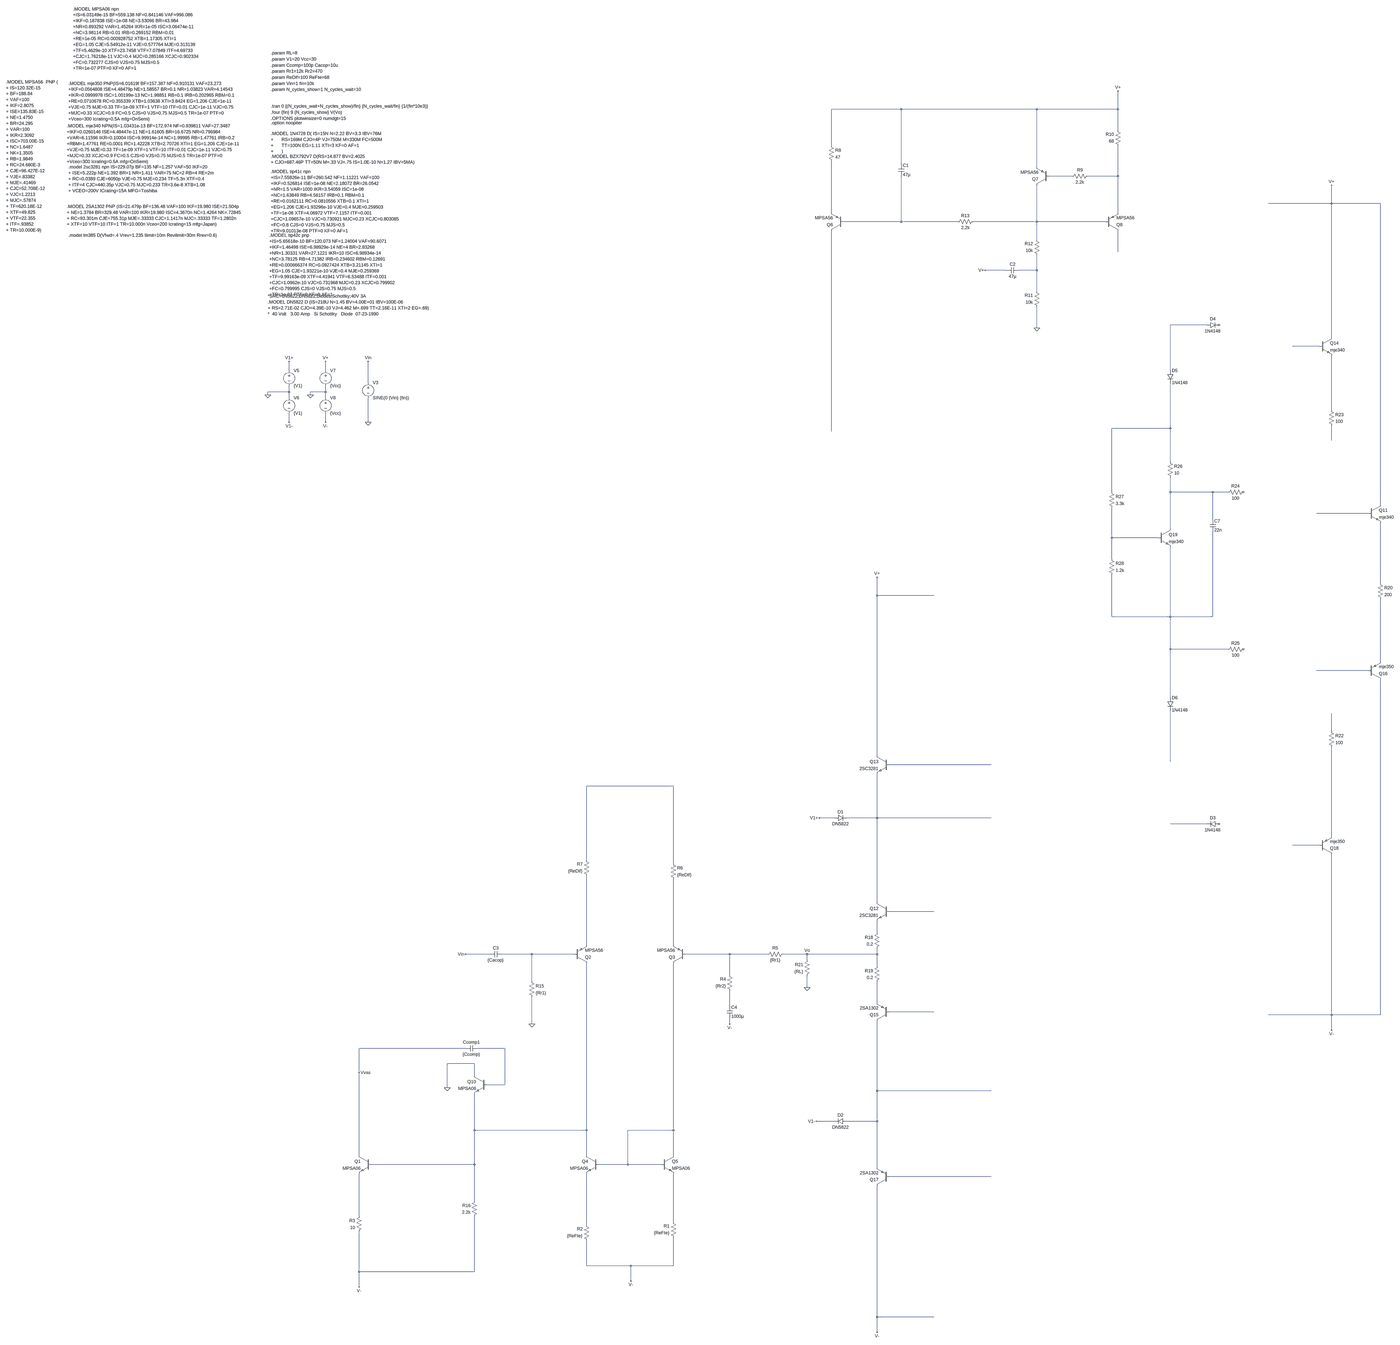
[diagram p0: schematic pcb.asc, whole sheet]
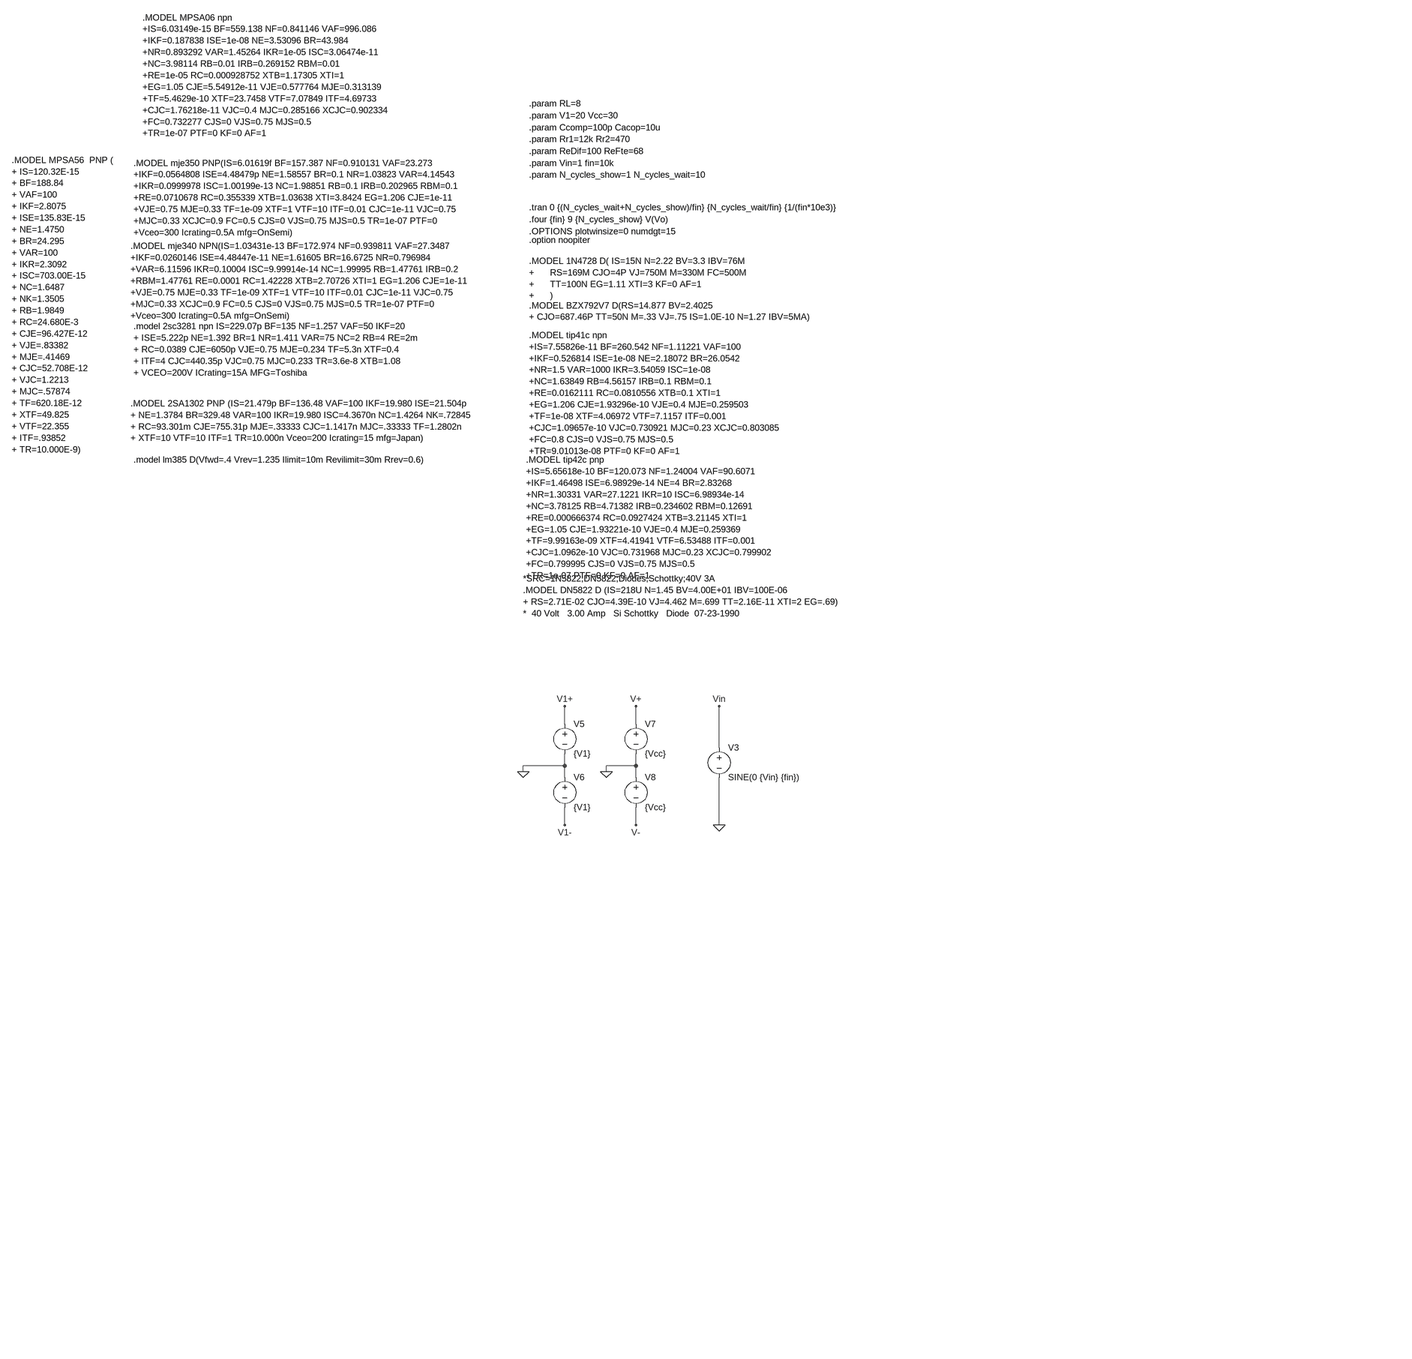
[diagram p1: schematic pcb.asc, part, row 1 of 2, column 1 of 2]
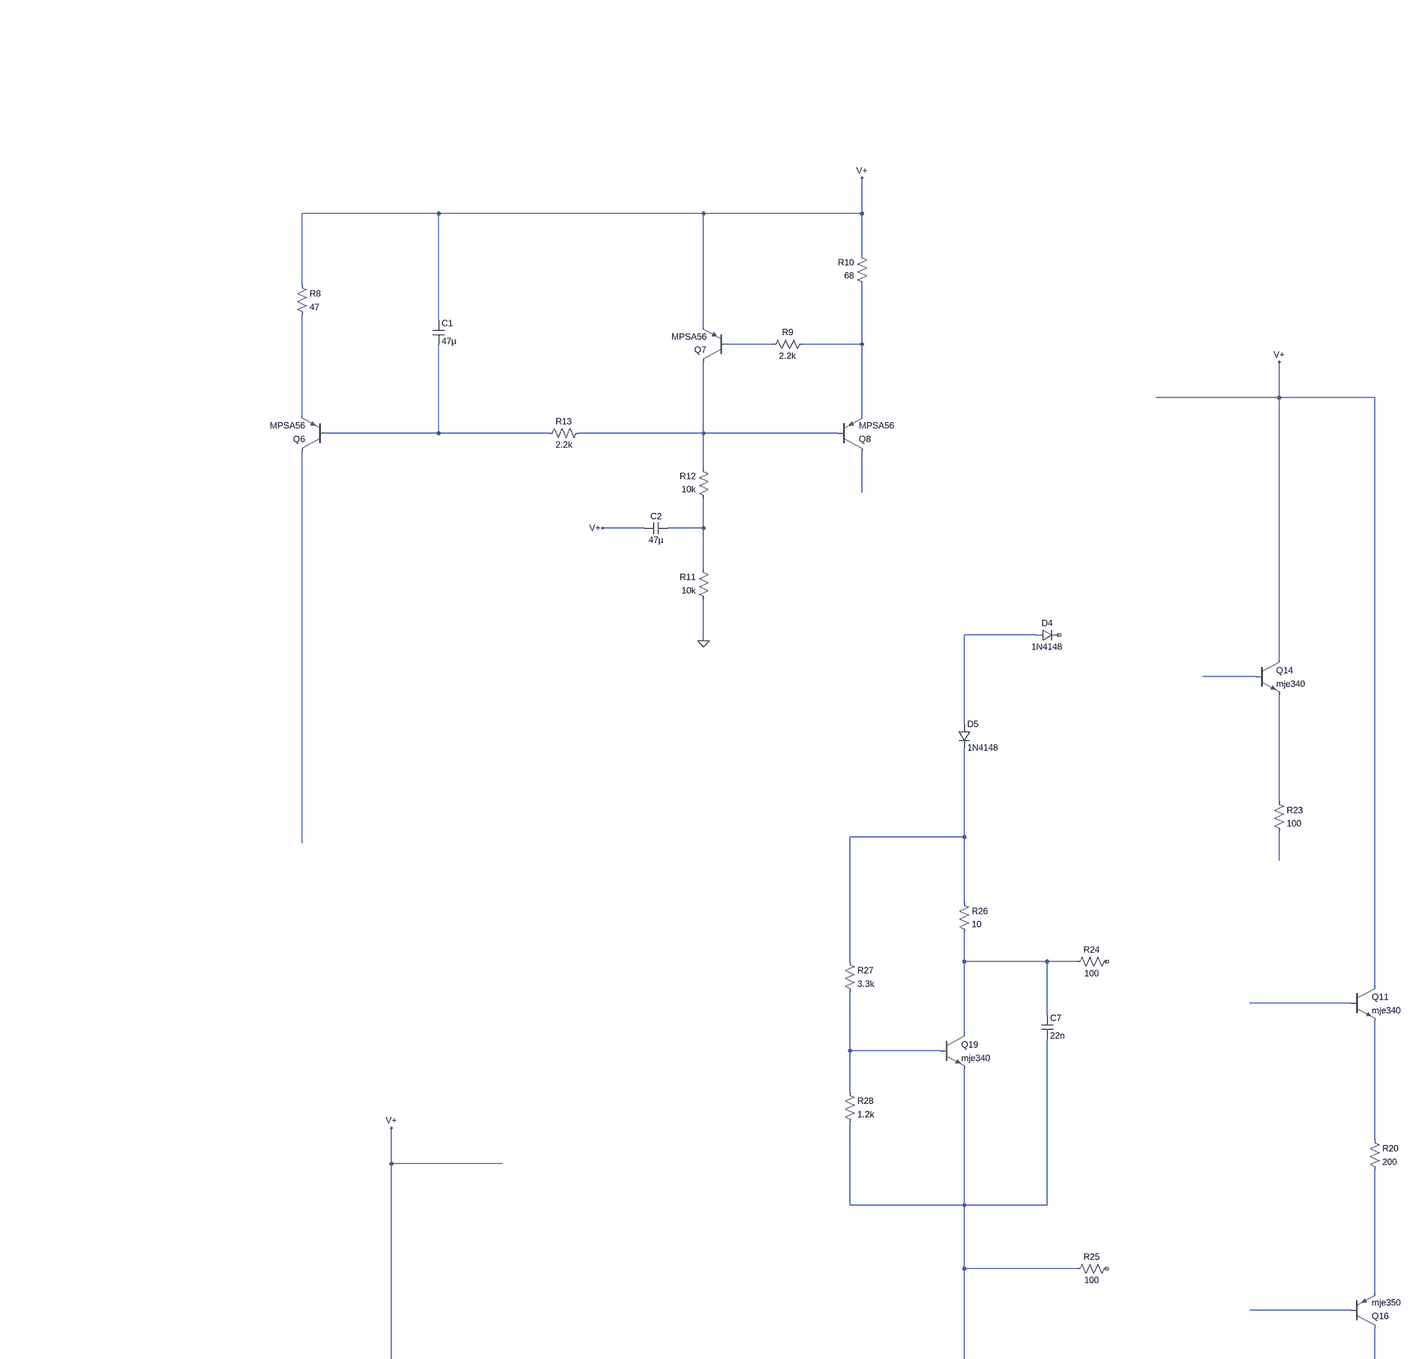
[diagram p2: schematic pcb.asc, part, row 1 of 2, column 2 of 2]
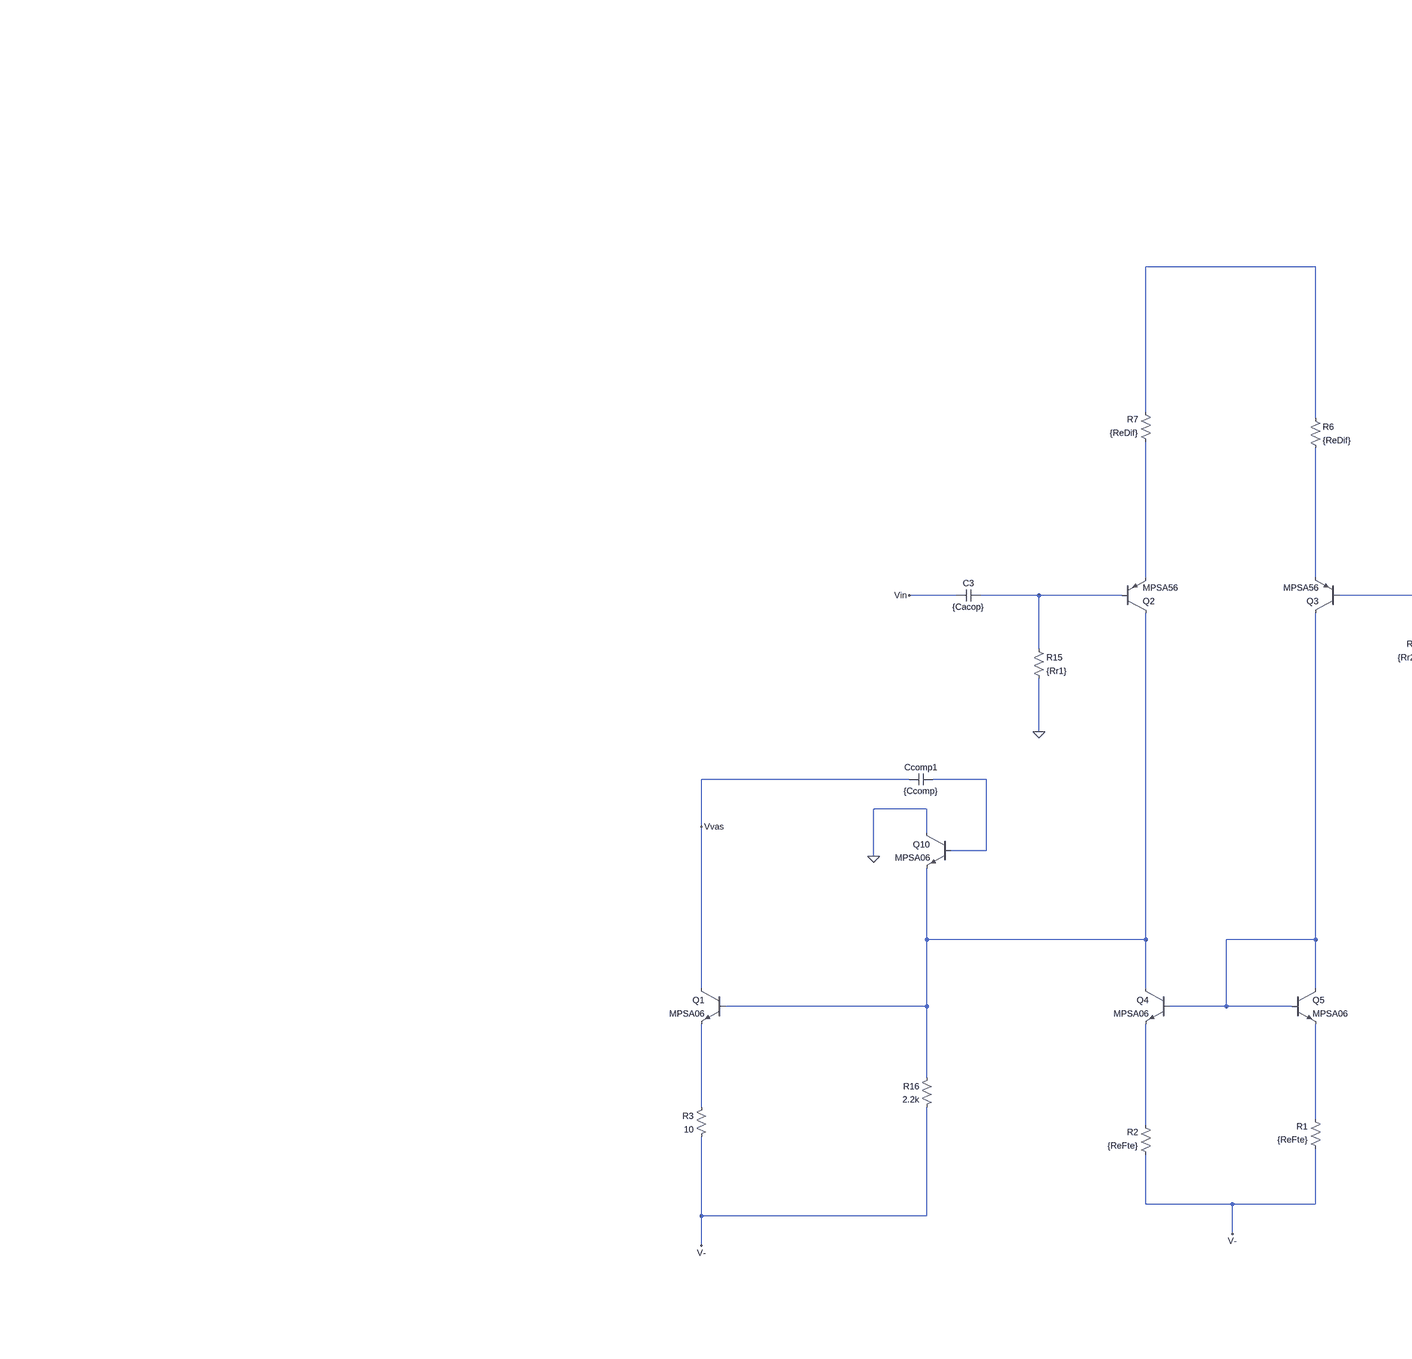
[diagram p3: schematic pcb.asc, part, row 2 of 2, column 1 of 2]
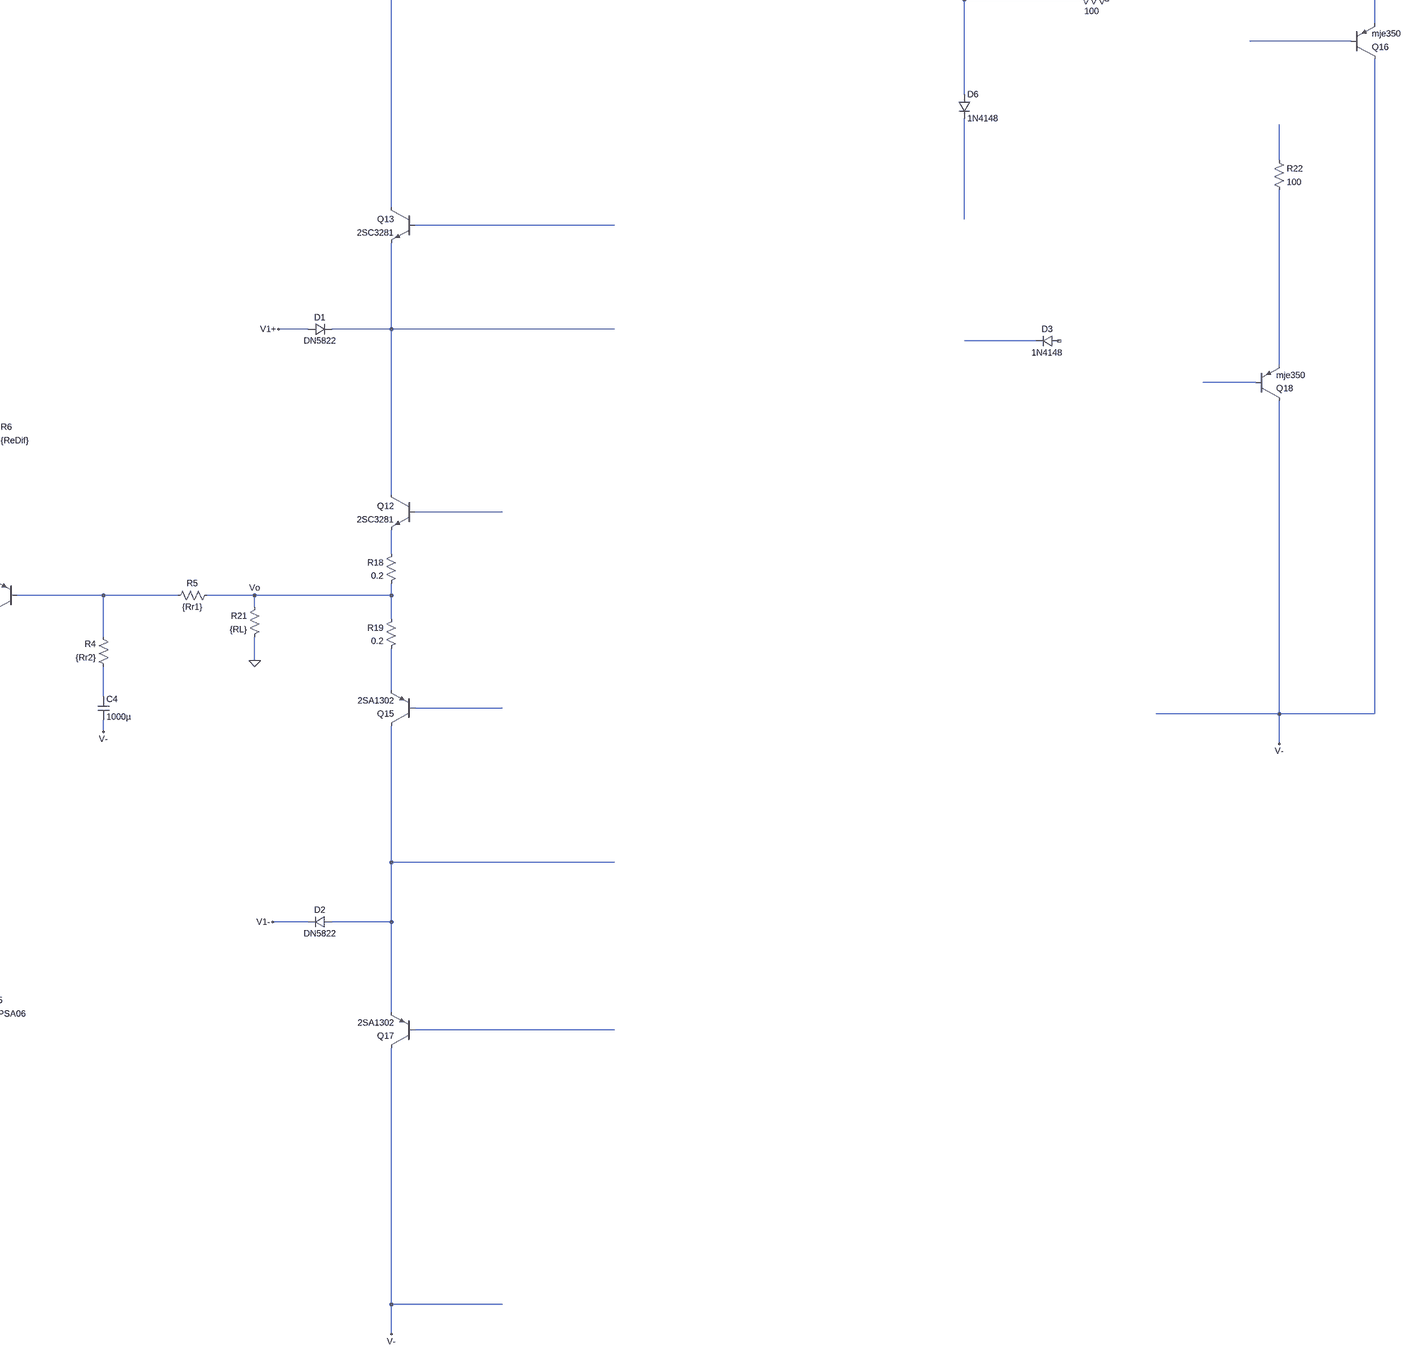
[diagram p4: schematic pcb.asc, part, row 2 of 2, column 2 of 2]
pcb.asc, the LTspice schematic file:
Version 4
SHEET 1 7264 3864
WIRE -3232 -3264 -3600 -3264
WIRE -2480 -3264 -3232 -3264
WIRE -1920 -3264 -1920 -3360
WIRE -1920 -3264 -2480 -3264
WIRE -1920 -3152 -1920 -3264
WIRE -3600 -3072 -3600 -3264
WIRE -3232 -2976 -3232 -3264
WIRE -2480 -2960 -2480 -3264
WIRE -2160 -2912 -2416 -2912
WIRE -1920 -2912 -1920 -3072
WIRE -1920 -2912 -2080 -2912
WIRE -320 -2768 -320 -2864
WIRE -320 -2768 -784 -2768
WIRE 0 -2768 -320 -2768
WIRE -3600 -2720 -3600 -2992
WIRE -1920 -2720 -1920 -2912
WIRE -3232 -2672 -3232 -2912
WIRE -3232 -2672 -3536 -2672
WIRE -2896 -2672 -3232 -2672
WIRE -2480 -2672 -2480 -2864
WIRE -2480 -2672 -2816 -2672
WIRE -1984 -2672 -2480 -2672
WIRE -2480 -2576 -2480 -2672
WIRE -1920 -2512 -1920 -2624
WIRE -2640 -2416 -2752 -2416
WIRE -2480 -2416 -2480 -2496
WIRE -2480 -2416 -2576 -2416
WIRE -2480 -2304 -2480 -2416
WIRE -1440 -2128 -1632 -2128
WIRE -2480 -2112 -2480 -2224
WIRE -320 -2064 -320 -2768
WIRE -384 -2016 -528 -2016
WIRE -6720 -1888 -6720 -1936
WIRE -6528 -1888 -6528 -1936
WIRE -1632 -1888 -1632 -2128
WIRE -6304 -1824 -6304 -1936
WIRE -6720 -1776 -6720 -1808
WIRE -6720 -1776 -6832 -1776
WIRE -6528 -1776 -6528 -1808
WIRE -6528 -1776 -6608 -1776
WIRE -6832 -1760 -6832 -1776
WIRE -6608 -1760 -6608 -1776
WIRE -6720 -1744 -6720 -1776
WIRE -6528 -1744 -6528 -1776
WIRE -320 -1680 -320 -1968
WIRE -6720 -1616 -6720 -1664
WIRE -6528 -1616 -6528 -1664
WIRE -6304 -1616 -6304 -1744
WIRE -1632 -1584 -1632 -1824
WIRE -1632 -1584 -1952 -1584
WIRE -3600 -1568 -3600 -2624
WIRE -320 -1520 -320 -1600
WIRE -1632 -1408 -1632 -1584
WIRE -1952 -1248 -1952 -1584
WIRE -1632 -1248 -1632 -1328
WIRE -1408 -1248 -1632 -1248
WIRE -1328 -1248 -1408 -1248
WIRE 0 -1184 0 -2768
WIRE -64 -1136 -400 -1136
WIRE -1408 -1104 -1408 -1248
WIRE -1632 -1056 -1632 -1248
WIRE -1952 -1008 -1952 -1168
WIRE -1696 -1008 -1952 -1008
WIRE -1952 -896 -1952 -1008
WIRE 0 -768 0 -1088
WIRE -3360 -704 -3360 -800
WIRE -3040 -704 -3360 -704
WIRE -1952 -592 -1952 -816
WIRE -1632 -592 -1632 -960
WIRE -1632 -592 -1952 -592
WIRE -1408 -592 -1408 -1040
WIRE -1408 -592 -1632 -592
WIRE -1632 -352 -1632 -592
WIRE -1328 -352 -1632 -352
WIRE 0 -288 0 -688
WIRE -64 -240 -400 -240
WIRE -1632 -96 -1632 -352
WIRE -320 80 -320 -16
WIRE -3360 208 -3360 -704
WIRE -1632 240 -1632 -32
WIRE -2720 256 -3296 256
WIRE -4624 368 -5120 368
WIRE -3584 544 -3664 544
WIRE -3360 544 -3360 304
WIRE -3360 544 -3520 544
WIRE -2720 544 -3360 544
WIRE -1440 576 -1632 576
WIRE -320 640 -320 160
WIRE -384 688 -528 688
WIRE -5120 768 -5120 368
WIRE -4624 784 -4624 368
WIRE -3360 1056 -3360 544
WIRE -3040 1104 -3296 1104
WIRE -3360 1216 -3360 1152
WIRE -5120 1280 -5120 848
WIRE -4624 1280 -4624 864
WIRE -5664 1328 -5792 1328
WIRE -5408 1328 -5600 1328
WIRE -5184 1328 -5408 1328
WIRE -4208 1328 -4560 1328
WIRE -3936 1328 -4208 1328
WIRE -3728 1328 -3856 1328
WIRE -3360 1328 -3360 1296
WIRE -3360 1328 -3728 1328
WIRE -3728 1360 -3728 1328
WIRE -3360 1392 -3360 1328
WIRE -4208 1440 -4208 1328
WIRE -5408 1472 -5408 1328
WIRE -3728 1504 -3728 1440
WIRE -3360 1584 -3360 1472
WIRE -4208 1600 -4208 1520
WIRE -3040 1632 -3296 1632
WIRE -320 1648 -320 736
WIRE -320 1648 -784 1648
WIRE 0 1648 0 -192
WIRE 0 1648 -320 1648
WIRE -5408 1696 -5408 1552
WIRE -4208 1696 -4208 1664
WIRE -320 1728 -320 1648
WIRE -5792 1824 -6352 1824
WIRE -5584 1824 -5728 1824
WIRE -5744 1904 -5888 1904
WIRE -6352 1952 -6352 1824
WIRE -5744 1968 -5744 1904
WIRE -5584 2016 -5584 1824
WIRE -5584 2016 -5680 2016
WIRE -5888 2032 -5888 1904
WIRE -3360 2048 -3360 1680
WIRE -2720 2048 -3360 2048
WIRE -3584 2208 -3680 2208
WIRE -3360 2208 -3360 2048
WIRE -3360 2208 -3520 2208
WIRE -5744 2256 -5744 2064
WIRE -5120 2256 -5120 1376
WIRE -5120 2256 -5744 2256
WIRE -4624 2256 -4624 1376
WIRE -4624 2256 -4864 2256
WIRE -6352 2416 -6352 1952
WIRE -5120 2416 -5120 2256
WIRE -4624 2416 -4624 2256
WIRE -5744 2464 -5744 2256
WIRE -5744 2464 -6288 2464
WIRE -4864 2464 -4864 2256
WIRE -4864 2464 -5056 2464
WIRE -4688 2464 -4864 2464
WIRE -3360 2480 -3360 2208
WIRE -2720 2528 -3296 2528
WIRE -5744 2656 -5744 2464
WIRE -6352 2736 -6352 2512
WIRE -4624 2768 -4624 2512
WIRE -5120 2784 -5120 2512
WIRE -5120 3088 -5120 2864
WIRE -4848 3088 -5120 3088
WIRE -4624 3088 -4624 2848
WIRE -4624 3088 -4848 3088
WIRE -6352 3120 -6352 2816
WIRE -5744 3120 -5744 2736
WIRE -5744 3120 -6352 3120
WIRE -4848 3168 -4848 3088
WIRE -6352 3200 -6352 3120
WIRE -3360 3712 -3360 2576
WIRE -3040 3712 -3360 3712
WIRE -3360 3792 -3360 3712
FLAG -6304 -1616 0
FLAG -6304 -1936 Vin
FLAG -2480 -2112 0
FLAG -2752 -2416 V+
FLAG -4208 1696 V-
FLAG -5408 1696 0
FLAG -5792 1328 Vin
FLAG -5888 2032 0
FLAG -6352 3200 V-
FLAG -1920 -3360 V+
FLAG -3728 1504 0
FLAG -3664 544 V1+
FLAG -3680 2208 V1-
FLAG -6832 -1760 0
FLAG -6608 -1760 0
FLAG -6720 -1616 V1-
FLAG -6720 -1936 V1+
FLAG -6528 -1936 V+
FLAG -6528 -1616 V-
FLAG -3728 1328 Vo
FLAG -6352 1952 Vvas
FLAG -320 -2864 V+
FLAG -3360 -800 V+
FLAG -4848 3168 V-
FLAG -320 1728 V-
FLAG -3360 3792 V-
DATAFLAG -4208 1328 ""
DATAFLAG -4864 368 ""
DATAFLAG -1632 -352 ""
DATAFLAG -1632 -1584 ""
DATAFLAG -1632 -1248 ""
DATAFLAG -176 -1136 ""
DATAFLAG -192 -240 ""
DATAFLAG 0 -960 ""
DATAFLAG -1920 -2512 ""
DATAFLAG -1280 -2128 ""
DATAFLAG -5408 1328 ""
DATAFLAG -3600 -2272 "Ic(Q6)"
DATAFLAG -5120 592 "-I(R7)"
DATAFLAG -4624 592 "I(R6)"
DATAFLAG -5120 1552 "-Ic(Q2)"
DATAFLAG -4624 1536 "-Ic(Q3)"
DATAFLAG -5120 2656 ""
DATAFLAG -4624 2656 ""
DATAFLAG -5120 1984 ""
DATAFLAG -4624 2256 ""
DATAFLAG -5744 2464 ""
DATAFLAG -5744 2224 "Ic(Q10)"
DATAFLAG -6352 1824 ""
DATAFLAG -6352 2144 "Ic(Q1)"
DATAFLAG -6352 2640 ""
DATAFLAG -6352 2944 "I(R3)"
DATAFLAG -3360 1328 ""
DATAFLAG -3600 -2864 ""
DATAFLAG -1920 -2928 ""
DATAFLAG -2480 -2672 ""
DATAFLAG -3248 -2672 ""
DATAFLAG 0 -432 ""
DATAFLAG -1312 576 ""
SYMBOL res -4608 2864 R180
WINDOW 0 36 76 Left 2
WINDOW 3 36 40 Left 2
SYMATTR InstName R1
SYMATTR Value {ReFte}
SYMBOL res -5104 2880 R180
WINDOW 0 36 76 Left 2
WINDOW 3 36 40 Left 2
SYMATTR InstName R2
SYMATTR Value {ReFte}
SYMBOL npn -6288 2416 M0
SYMATTR InstName Q1
SYMATTR Value MPSA06
SYMBOL voltage -6304 -1840 R0
WINDOW 123 0 0 Left 2
WINDOW 39 0 0 Left 2
SYMATTR InstName V3
SYMATTR Value SINE(0 {Vin} {fin})
SYMBOL res -6336 2720 M0
SYMATTR InstName R3
SYMATTR Value 10
SYMBOL res -4192 1536 R180
WINDOW 0 36 76 Left 2
WINDOW 3 36 40 Left 2
SYMATTR InstName R4
SYMATTR Value {Rr2}
SYMBOL pnp -5184 1376 M180
SYMATTR InstName Q2
SYMATTR Value MPSA56
SYMBOL pnp -4560 1376 R180
SYMATTR InstName Q3
SYMATTR Value MPSA56
SYMBOL npn -5056 2416 M0
SYMATTR InstName Q4
SYMATTR Value MPSA06
SYMBOL npn -4688 2416 R0
SYMATTR InstName Q5
SYMATTR Value MPSA06
SYMBOL res -3840 1312 R90
WINDOW 0 0 56 VBottom 2
WINDOW 3 32 56 VTop 2
SYMATTR InstName R5
SYMATTR Value {Rr1}
SYMBOL res -4640 768 R0
SYMATTR InstName R6
SYMATTR Value {ReDif}
SYMBOL res -5104 864 R180
WINDOW 0 36 76 Left 2
WINDOW 3 36 40 Left 2
SYMATTR InstName R7
SYMATTR Value {ReDif}
SYMBOL pnp -3536 -2624 R180
SYMATTR InstName Q6
SYMATTR Value MPSA56
SYMBOL pnp -2416 -2864 R180
SYMATTR InstName Q7
SYMATTR Value MPSA56
SYMBOL pnp -1984 -2624 M180
SYMATTR InstName Q8
SYMATTR Value MPSA56
SYMBOL cap -3248 -2976 R0
SYMATTR InstName C1
SYMATTR Value 47µ
SYMBOL cap -2640 -2400 R270
WINDOW 0 32 32 VTop 2
WINDOW 3 0 32 VBottom 2
SYMATTR InstName C2
SYMATTR Value 47µ
SYMBOL res -3616 -3088 R0
SYMATTR InstName R8
SYMATTR Value 47
SYMBOL res -2064 -2928 R90
WINDOW 0 0 56 VBottom 2
WINDOW 3 32 56 VTop 2
SYMATTR InstName R9
SYMATTR Value 2.2k
SYMBOL res -1904 -3056 R180
WINDOW 0 36 76 Left 2
WINDOW 3 36 40 Left 2
SYMATTR InstName R10
SYMATTR Value 68
SYMBOL res -2464 -2208 R180
WINDOW 0 36 76 Left 2
WINDOW 3 36 40 Left 2
SYMATTR InstName R11
SYMATTR Value 10k
SYMBOL res -2464 -2480 R180
WINDOW 0 36 76 Left 2
WINDOW 3 36 40 Left 2
SYMATTR InstName R12
SYMATTR Value 10k
SYMBOL res -2912 -2656 R270
WINDOW 0 32 56 VTop 2
WINDOW 3 0 56 VBottom 2
SYMATTR InstName R13
SYMATTR Value 2.2k
SYMBOL res -5424 1456 R0
SYMATTR InstName R15
SYMATTR Value {Rr1}
SYMBOL cap -5600 1312 R90
WINDOW 0 0 32 VBottom 2
WINDOW 3 32 32 VTop 2
SYMATTR InstName C3
SYMATTR Value {Cacop}
SYMBOL cap -4224 1600 R0
SYMATTR InstName C4
SYMATTR Value 1000µ
SYMBOL npn -5680 1968 M0
SYMATTR InstName Q10
SYMATTR Value MPSA06
SYMBOL res -5728 2640 M0
SYMATTR InstName R16
SYMATTR Value 2.2k
SYMBOL cap -5792 1808 M90
WINDOW 0 0 32 VBottom 2
WINDOW 3 32 32 VTop 2
SYMATTR InstName Ccomp1
SYMATTR Value {Ccomp}
SYMBOL npn -64 -1184 R0
SYMATTR InstName Q11
SYMATTR Value mje340
SYMBOL npn -3296 1056 M0
SYMATTR InstName Q12
SYMATTR Value 2SC3281
SYMBOL npn -3296 208 M0
SYMATTR InstName Q13
SYMATTR Value 2SC3281
SYMBOL npn -384 -2064 R0
SYMATTR InstName Q14
SYMATTR Value mje340
SYMBOL res -3344 1200 M0
SYMATTR InstName R18
SYMATTR Value 0.2
SYMBOL res -3344 1376 M0
SYMATTR InstName R19
SYMATTR Value 0.2
SYMBOL pnp -3296 1680 R180
SYMATTR InstName Q15
SYMATTR Value 2SA1302
SYMBOL pnp -64 -192 M180
SYMATTR InstName Q16
SYMATTR Value mje350
SYMBOL pnp -3296 2576 R180
SYMATTR InstName Q17
SYMATTR Value 2SA1302
SYMBOL pnp -384 736 M180
SYMATTR InstName Q18
SYMATTR Value mje350
SYMBOL res -16 -784 R0
SYMATTR InstName R20
SYMATTR Value 200
SYMBOL res -3712 1344 M0
SYMATTR InstName R21
SYMATTR Value {RL}
SYMBOL res -336 64 R0
SYMATTR InstName R22
SYMATTR Value 100
SYMBOL res -336 -1696 R0
SYMATTR InstName R23
SYMATTR Value 100
SYMBOL diode -1376 560 R90
WINDOW 0 0 32 VBottom 2
WINDOW 3 32 32 VTop 2
SYMATTR InstName D3
SYMATTR Value 1N4148
SYMBOL diode -1440 -2112 R270
WINDOW 0 32 32 VTop 2
WINDOW 3 0 32 VBottom 2
SYMATTR InstName D4
SYMATTR Value 1N4148
SYMBOL voltage -6720 -1904 R0
WINDOW 123 0 0 Left 2
WINDOW 39 0 0 Left 2
SYMATTR InstName V5
SYMATTR Value {V1}
SYMBOL voltage -6720 -1760 R0
WINDOW 123 0 0 Left 2
WINDOW 39 0 0 Left 2
SYMATTR InstName V6
SYMATTR Value {V1}
SYMBOL voltage -6528 -1904 R0
WINDOW 123 0 0 Left 2
WINDOW 39 0 0 Left 2
SYMATTR InstName V7
SYMATTR Value {Vcc}
SYMBOL voltage -6528 -1760 R0
WINDOW 123 0 0 Left 2
WINDOW 39 0 0 Left 2
SYMATTR InstName V8
SYMATTR Value {Vcc}
SYMBOL npn -1696 -1056 R0
SYMATTR InstName Q19
SYMATTR Value mje340
SYMBOL res -1232 -1264 R90
WINDOW 0 0 56 VBottom 2
WINDOW 3 32 56 VTop 2
SYMATTR InstName R24
SYMATTR Value 100
SYMBOL res -1232 -368 R90
WINDOW 0 0 56 VBottom 2
WINDOW 3 32 56 VTop 2
SYMATTR InstName R25
SYMATTR Value 100
SYMBOL res -1648 -1424 R0
SYMATTR InstName R26
SYMATTR Value 10
SYMBOL res -1968 -1264 R0
SYMATTR InstName R27
SYMATTR Value 3.3k
SYMBOL res -1968 -912 R0
SYMATTR InstName R28
SYMATTR Value 1.2k
SYMBOL cap -1424 -1104 R0
SYMATTR InstName C7
SYMATTR Value 22n
SYMBOL diode -1648 -1888 R0
SYMATTR InstName D5
SYMATTR Value 1N4148
SYMBOL diode -1648 -96 R0
SYMATTR InstName D6
SYMATTR Value 1N4148
SYMBOL diode -3584 528 M90
WINDOW 0 0 32 VBottom 2
WINDOW 3 32 32 VTop 2
SYMATTR InstName D1
SYMATTR Value DN5822
SYMBOL diode -3520 2224 M270
WINDOW 0 32 32 VTop 2
WINDOW 3 0 32 VBottom 2
SYMATTR InstName D2
SYMATTR Value DN5822
TEXT -6816 -3280 Left 2 !.tran 0 {(N_cycles_wait+N_cycles_show)/fin} {N_cycles_wait/fin} {1/(fin*10e3)}
TEXT -6816 -3248 Left 2 !.four {fin} 9 {N_cycles_show} V(Vo)
TEXT -6816 -3216 Left 2 !.OPTIONS plotwinsize=0 numdgt=15
TEXT -6816 -3368 Left 2 !.param N_cycles_show=1 N_cycles_wait=10
TEXT -6816 -3400 Left 2 !.param Vin=1 fin=10k
TEXT -6816 -3432 Left 2 !.param ReDif=100 ReFte=68
TEXT -6816 -3464 Left 2 !.param Rr1=12k Rr2=470
TEXT -6816 -3496 Left 2 !.param Ccomp=100p Cacop=10u
TEXT -6816 -3528 Left 2 !.param V1=20 Vcc=30
TEXT -6816 -3136 Left 2 !.MODEL 1N4728 D( IS=15N N=2.22 BV=3.3 IBV=76M \n+      RS=169M CJO=4P VJ=750M M=330M FC=500M \n+      TT=100N EG=1.11 XTI=3 KF=0 AF=1 \n+      )
TEXT -6816 -3016 Left 2 !.MODEL BZX792V7 D(RS=14.877 BV=2.4025  \n+ CJO=687.46P TT=50N M=.33 VJ=.75 IS=1.0E-10 N=1.27 IBV=5MA)
TEXT -6816 -2936 Left 2 !.MODEL tip41c npn\n+IS=7.55826e-11 BF=260.542 NF=1.11221 VAF=100\n+IKF=0.526814 ISE=1e-08 NE=2.18072 BR=26.0542\n+NR=1.5 VAR=1000 IKR=3.54059 ISC=1e-08\n+NC=1.63849 RB=4.56157 IRB=0.1 RBM=0.1\n+RE=0.0162111 RC=0.0810556 XTB=0.1 XTI=1\n+EG=1.206 CJE=1.93296e-10 VJE=0.4 MJE=0.259503\n+TF=1e-08 XTF=4.06972 VTF=7.1157 ITF=0.001\n+CJC=1.09657e-10 VJC=0.730921 MJC=0.23 XCJC=0.803085\n+FC=0.8 CJS=0 VJS=0.75 MJS=0.5\n+TR=9.01013e-08 PTF=0 KF=0 AF=1
TEXT -6824 -2600 Left 2 !.MODEL tip42c pnp\n+IS=5.65618e-10 BF=120.073 NF=1.24004 VAF=90.6071\n+IKF=1.46498 ISE=6.98929e-14 NE=4 BR=2.83268\n+NR=1.30331 VAR=27.1221 IKR=10 ISC=6.98934e-14\n+NC=3.78125 RB=4.71382 IRB=0.234602 RBM=0.12691\n+RE=0.000666374 RC=0.0927424 XTB=3.21145 XTI=1\n+EG=1.05 CJE=1.93221e-10 VJE=0.4 MJE=0.259369\n+TF=9.99163e-09 XTF=4.41941 VTF=6.53488 ITF=0.001\n+CJC=1.0962e-10 VJC=0.731968 MJC=0.23 XCJC=0.799902\n+FC=0.799995 CJS=0 VJS=0.75 MJS=0.5\n+TR=1e-07 PTF=0 KF=0 AF=1
TEXT -6832 -2280 Left 2 !*SRC=1N5822;DN5822;Diodes;Schottky;40V 3A\n.MODEL DN5822 D (IS=218U N=1.45 BV=4.00E+01 IBV=100E-06\n+ RS=2.71E-02 CJO=4.39E-10 VJ=4.462 M=.699 TT=2.16E-11 XTI=2 EG=.69)\n*  40 Volt   3.00 Amp   Si Schottky   Diode  07-23-1990
TEXT -8024 -2960 Left 2 !.model 2sc3281 npn IS=229.07p BF=135 NF=1.257 VAF=50 IKF=20\n+ ISE=5.222p NE=1.392 BR=1 NR=1.411 VAR=75 NC=2 RB=4 RE=2m\n+ RC=0.0389 CJE=6050p VJE=0.75 MJE=0.234 TF=5.3n XTF=0.4\n+ ITF=4 CJC=440.35p VJC=0.75 MJC=0.233 TR=3.6e-8 XTB=1.08\n+ VCEO=200V ICrating=15A MFG=Toshiba
TEXT -8032 -2752 Left 2 !.MODEL 2SA1302 PNP (IS=21.479p BF=136.48 VAF=100 IKF=19.980 ISE=21.504p\n+ NE=1.3784 BR=329.48 VAR=100 IKR=19.980 ISC=4.3670n NC=1.4264 NK=.72845\n+ RC=93.301m CJE=755.31p MJE=.33333 CJC=1.1417n MJC=.33333 TF=1.2802n\n+ XTF=10 VTF=10 ITF=1 TR=10.000n Vceo=200 Icrating=15 mfg=Japan)
TEXT -8032 -3176 Left 2 !.MODEL mje340 NPN(IS=1.03431e-13 BF=172.974 NF=0.939811 VAF=27.3487\n+IKF=0.0260146 ISE=4.48447e-11 NE=1.61605 BR=16.6725 NR=0.796984\n+VAR=6.11596 IKR=0.10004 ISC=9.99914e-14 NC=1.99995 RB=1.47761 IRB=0.2\n+RBM=1.47761 RE=0.0001 RC=1.42228 XTB=2.70726 XTI=1 EG=1.206 CJE=1e-11\n+VJE=0.75 MJE=0.33 TF=1e-09 XTF=1 VTF=10 ITF=0.01 CJC=1e-11 VJC=0.75\n+MJC=0.33 XCJC=0.9 FC=0.5 CJS=0 VJS=0.75 MJS=0.5 TR=1e-07 PTF=0\n+Vceo=300 Icrating=0.5A mfg=OnSemi)
TEXT -8024 -3400 Left 2 !.MODEL mje350 PNP(IS=6.01619f BF=157.387 NF=0.910131 VAF=23.273\n+IKF=0.0564808 ISE=4.48479p NE=1.58557 BR=0.1 NR=1.03823 VAR=4.14543\n+IKR=0.0999978 ISC=1.00199e-13 NC=1.98851 RB=0.1 IRB=0.202965 RBM=0.1\n+RE=0.0710678 RC=0.355339 XTB=1.03638 XTI=3.8424 EG=1.206 CJE=1e-11\n+VJE=0.75 MJE=0.33 TF=1e-09 XTF=1 VTF=10 ITF=0.01 CJC=1e-11 VJC=0.75\n+MJC=0.33 XCJC=0.9 FC=0.5 CJS=0 VJS=0.75 MJS=0.5 TR=1e-07 PTF=0\n+Vceo=300 Icrating=0.5A mfg=OnSemi)
TEXT -6816 -3560 Left 2 !.param RL=8
TEXT -8352 -3408 Left 2 !.MODEL MPSA56  PNP (\n+ IS=120.32E-15\n+ BF=188.84\n+ VAF=100\n+ IKF=2.8075\n+ ISE=135.83E-15\n+ NE=1.4750\n+ BR=24.295\n+ VAR=100\n+ IKR=2.3092\n+ ISC=703.00E-15\n+ NC=1.6487\n+ NK=1.3505\n+ RB=1.9849\n+ RC=24.680E-3\n+ CJE=96.427E-12\n+ VJE=.83382\n+ MJE=.41469\n+ CJC=52.708E-12\n+ VJC=1.2213\n+ MJC=.57874\n+ TF=620.18E-12\n+ XTF=49.825\n+ VTF=22.355\n+ ITF=.93852\n+ TR=10.000E-9)
TEXT -8000 -3792 Left 2 !.MODEL MPSA06 npn\n+IS=6.03149e-15 BF=559.138 NF=0.841146 VAF=996.086\n+IKF=0.187838 ISE=1e-08 NE=3.53096 BR=43.984\n+NR=0.893292 VAR=1.45264 IKR=1e-05 ISC=3.06474e-11\n+NC=3.98114 RB=0.01 IRB=0.269152 RBM=0.01\n+RE=1e-05 RC=0.000928752 XTB=1.17305 XTI=1\n+EG=1.05 CJE=5.54912e-11 VJE=0.577764 MJE=0.313139\n+TF=5.4629e-10 XTF=23.7458 VTF=7.07849 ITF=4.69733\n+CJC=1.76218e-11 VJC=0.4 MJC=0.285166 XCJC=0.902334\n+FC=0.732277 CJS=0 VJS=0.75 MJS=0.5\n+TR=1e-07 PTF=0 KF=0 AF=1
TEXT -6816 -3192 Left 2 !.option noopiter
TEXT -8024 -2600 Left 2 !.model lm385 D(Vfwd=.4 Vrev=1.235 Ilimit=10m Revilimit=30m Rrev=0.6)

The netlist it stands for:
* pcb.asc
R1 V- N044 {ReFte}
R2 V- N045 {ReFte}
Q1 Vvas N040 N043 0 MPSA06
V3 Vin 0 SINE(0 {Vin} {fin})
R3 N043 V- 10
R4 N036 N034 {Rr2}
Q2 N040 N033 N031 0 MPSA56
Q3 N041 N034 N032 0 MPSA56
Q4 N040 N041 N045 0 MPSA06
Q5 N041 N041 N044 0 MPSA06
R5 Vo N034 {Rr1}
R6 N024 N032 {ReDif}
R7 N031 N024 {ReDif}
Q6 N012 N004 N003 0 MPSA56
Q7 N005 N001 V+ 0 MPSA56
Q8 N006 N005 N002 0 MPSA56
C1 V+ N004 47µ
C2 V+ N007 47µ
R8 V+ N003 47
R9 N002 N001 2.2k
R10 N002 V+ 68
R11 0 N007 10k
R12 N007 N005 10k
R13 N004 N005 2.2k
R15 N033 0 {Rr1}
C3 N033 Vin {Cacop}
C4 N036 V- 1000µ
Q10 0 N038 N040 0 MPSA06
R16 N040 V- 2.2k
Ccomp1 Vvas N038 {Ccomp}
Q11 V+ N015 N017 0 mje340
Q12 N025 N029 N030 0 2SC3281
Q13 V+ N023 N025 0 2SC3281
Q14 V+ N009 N010 0 mje340
R18 N030 Vo 0.2
R19 Vo N035 0.2
Q15 N039 N037 N035 0 2SA1302
Q16 V- N020 N019 0 mje350
Q17 V- N042 N039 0 2SA1302
Q18 V- N028 N027 0 mje350
R20 N017 N019 200
R21 Vo 0 {RL}
R22 N021 N027 100
R23 N010 N013 100
D3 NC_01 N026 1N4148
D4 N008 NC_02 1N4148
V5 V1+ 0 {V1}
V6 0 V1- {V1}
V7 V+ 0 {Vcc}
V8 0 V- {Vcc}
Q19 N014 N016 N018 0 mje340
R24 NC_03 N014 100
R25 NC_04 N018 100
R26 N011 N014 10
R27 N011 N016 3.3k
R28 N016 N018 1.2k
C7 N014 N018 22n
D5 N008 N011 1N4148
D6 N018 N022 1N4148
D1 V1+ N025 DN5822
D2 N039 V1- DN5822
.model D D
.lib standard.dio
.model NPN NPN
.model PNP PNP
.lib standard.bjt
.tran 0 {(N_cycles_wait+N_cycles_show)/fin} {N_cycles_wait/fin} {1/(fin*10e3)}
.four {fin} 9 {N_cycles_show} V(Vo)
.OPTIONS plotwinsize=0 numdgt=15
.param N_cycles_show=1 N_cycles_wait=10
.param Vin=1 fin=10k
.param ReDif=100 ReFte=68
.param Rr1=12k Rr2=470
.param Ccomp=100p Cacop=10u
.param V1=20 Vcc=30
.MODEL 1N4728 D( IS=15N N=2.22 BV=3.3 IBV=76M
+      RS=169M CJO=4P VJ=750M M=330M FC=500M
+      TT=100N EG=1.11 XTI=3 KF=0 AF=1
+      )
.MODEL BZX792V7 D(RS=14.877 BV=2.4025
+ CJO=687.46P TT=50N M=.33 VJ=.75 IS=1.0E-10 N=1.27 IBV=5MA)
.MODEL tip41c npn
+IS=7.55826e-11 BF=260.542 NF=1.11221 VAF=100
+IKF=0.526814 ISE=1e-08 NE=2.18072 BR=26.0542
+NR=1.5 VAR=1000 IKR=3.54059 ISC=1e-08
+NC=1.63849 RB=4.56157 IRB=0.1 RBM=0.1
+RE=0.0162111 RC=0.0810556 XTB=0.1 XTI=1
+EG=1.206 CJE=1.93296e-10 VJE=0.4 MJE=0.259503
+TF=1e-08 XTF=4.06972 VTF=7.1157 ITF=0.001
+CJC=1.09657e-10 VJC=0.730921 MJC=0.23 XCJC=0.803085
+FC=0.8 CJS=0 VJS=0.75 MJS=0.5
+TR=9.01013e-08 PTF=0 KF=0 AF=1
.MODEL tip42c pnp
+IS=5.65618e-10 BF=120.073 NF=1.24004 VAF=90.6071
+IKF=1.46498 ISE=6.98929e-14 NE=4 BR=2.83268
+NR=1.30331 VAR=27.1221 IKR=10 ISC=6.98934e-14
+NC=3.78125 RB=4.71382 IRB=0.234602 RBM=0.12691
+RE=0.000666374 RC=0.0927424 XTB=3.21145 XTI=1
+EG=1.05 CJE=1.93221e-10 VJE=0.4 MJE=0.259369
+TF=9.99163e-09 XTF=4.41941 VTF=6.53488 ITF=0.001
+CJC=1.0962e-10 VJC=0.731968 MJC=0.23 XCJC=0.799902
+FC=0.799995 CJS=0 VJS=0.75 MJS=0.5
+TR=1e-07 PTF=0 KF=0 AF=1
*SRC=1N5822;DN5822;Diodes;Schottky;40V 3A
.MODEL DN5822 D (IS=218U N=1.45 BV=4.00E+01 IBV=100E-06
+ RS=2.71E-02 CJO=4.39E-10 VJ=4.462 M=.699 TT=2.16E-11 XTI=2 EG=.69)
*  40 Volt   3.00 Amp   Si Schottky   Diode  07-23-1990
.model 2sc3281 npn IS=229.07p BF=135 NF=1.257 VAF=50 IKF=20
+ ISE=5.222p NE=1.392 BR=1 NR=1.411 VAR=75 NC=2 RB=4 RE=2m
+ RC=0.0389 CJE=6050p VJE=0.75 MJE=0.234 TF=5.3n XTF=0.4
+ ITF=4 CJC=440.35p VJC=0.75 MJC=0.233 TR=3.6e-8 XTB=1.08
+ VCEO=200V ICrating=15A MFG=Toshiba
.MODEL 2SA1302 PNP (IS=21.479p BF=136.48 VAF=100 IKF=19.980 ISE=21.504p
+ NE=1.3784 BR=329.48 VAR=100 IKR=19.980 ISC=4.3670n NC=1.4264 NK=.72845
+ RC=93.301m CJE=755.31p MJE=.33333 CJC=1.1417n MJC=.33333 TF=1.2802n
+ XTF=10 VTF=10 ITF=1 TR=10.000n Vceo=200 Icrating=15 mfg=Japan)
.MODEL mje340 NPN(IS=1.03431e-13 BF=172.974 NF=0.939811 VAF=27.3487
+IKF=0.0260146 ISE=4.48447e-11 NE=1.61605 BR=16.6725 NR=0.796984
+VAR=6.11596 IKR=0.10004 ISC=9.99914e-14 NC=1.99995 RB=1.47761 IRB=0.2
+RBM=1.47761 RE=0.0001 RC=1.42228 XTB=2.70726 XTI=1 EG=1.206 CJE=1e-11
+VJE=0.75 MJE=0.33 TF=1e-09 XTF=1 VTF=10 ITF=0.01 CJC=1e-11 VJC=0.75
+MJC=0.33 XCJC=0.9 FC=0.5 CJS=0 VJS=0.75 MJS=0.5 TR=1e-07 PTF=0
+Vceo=300 Icrating=0.5A mfg=OnSemi)
.MODEL mje350 PNP(IS=6.01619f BF=157.387 NF=0.910131 VAF=23.273
+IKF=0.0564808 ISE=4.48479p NE=1.58557 BR=0.1 NR=1.03823 VAR=4.14543
+IKR=0.0999978 ISC=1.00199e-13 NC=1.98851 RB=0.1 IRB=0.202965 RBM=0.1
+RE=0.0710678 RC=0.355339 XTB=1.03638 XTI=3.8424 EG=1.206 CJE=1e-11
+VJE=0.75 MJE=0.33 TF=1e-09 XTF=1 VTF=10 ITF=0.01 CJC=1e-11 VJC=0.75
+MJC=0.33 XCJC=0.9 FC=0.5 CJS=0 VJS=0.75 MJS=0.5 TR=1e-07 PTF=0
+Vceo=300 Icrating=0.5A mfg=OnSemi)
.param RL=8
.MODEL MPSA56  PNP (
+ IS=120.32E-15
+ BF=188.84
+ VAF=100
+ IKF=2.8075
+ ISE=135.83E-15
+ NE=1.4750
+ BR=24.295
+ VAR=100
+ IKR=2.3092
+ ISC=703.00E-15
+ NC=1.6487
+ NK=1.3505
+ RB=1.9849
+ RC=24.680E-3
+ CJE=96.427E-12
+ VJE=.83382
+ MJE=.41469
+ CJC=52.708E-12
+ VJC=1.2213
+ MJC=.57874
+ TF=620.18E-12
+ XTF=49.825
+ VTF=22.355
+ ITF=.93852
+ TR=10.000E-9)
.MODEL MPSA06 npn
+IS=6.03149e-15 BF=559.138 NF=0.841146 VAF=996.086
+IKF=0.187838 ISE=1e-08 NE=3.53096 BR=43.984
+NR=0.893292 VAR=1.45264 IKR=1e-05 ISC=3.06474e-11
+NC=3.98114 RB=0.01 IRB=0.269152 RBM=0.01
+RE=1e-05 RC=0.000928752 XTB=1.17305 XTI=1
+EG=1.05 CJE=5.54912e-11 VJE=0.577764 MJE=0.313139
+TF=5.4629e-10 XTF=23.7458 VTF=7.07849 ITF=4.69733
+CJC=1.76218e-11 VJC=0.4 MJC=0.285166 XCJC=0.902334
+FC=0.732277 CJS=0 VJS=0.75 MJS=0.5
+TR=1e-07 PTF=0 KF=0 AF=1
.option noopiter
.model lm385 D(Vfwd=.4 Vrev=1.235 Ilimit=10m Revilimit=30m Rrev=0.6)
.backanno
.end